# EAGLE schematic Ex Sensors (EAGLE 7.6.0)
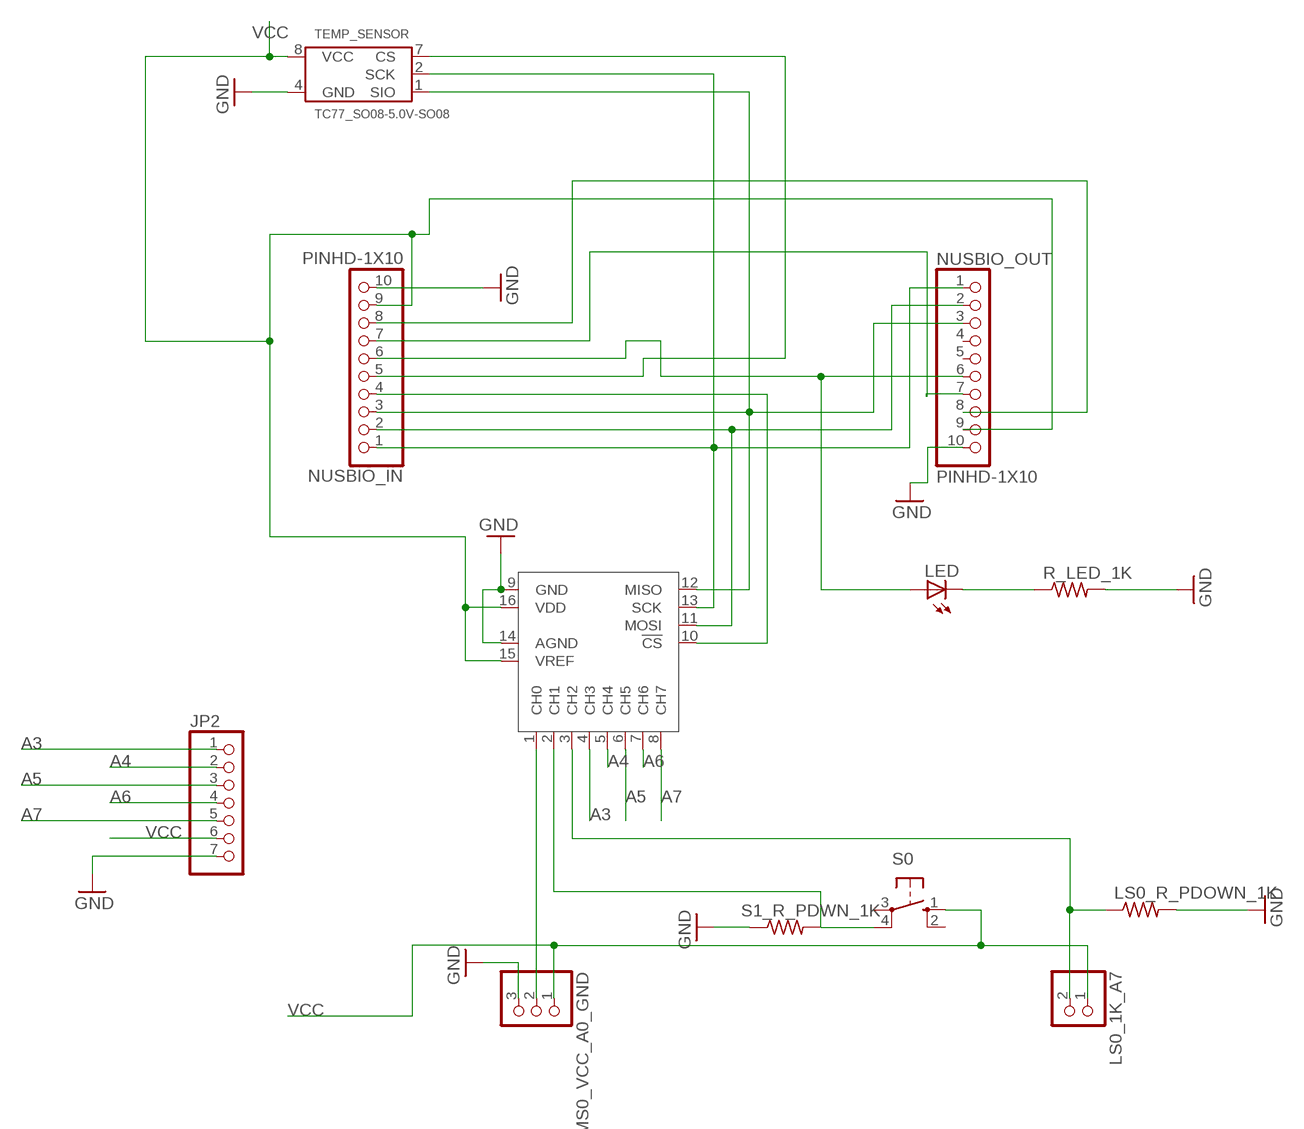
[diagram p0: schematic, sheet 1]

## Parts
JP2  PINHD-1X7  [1X07]
LED  LEDCHIPLED_0805  [CHIPLED_0805]
LS0_1K_A7  PINHD-1X2  [1X02]
LS0_R_PDOWN_1K  R-US_R0805  [R0805]
MS0_VCC_A0_GND  PINHD-1X3  [1X03]
NUSBIO_IN  PINHD-1X10  [1X10-BIG]
NUSBIO_OUT  PINHD-1X10  [1X10-BIG]
R_LED_1K  R-US_R0805  [R0805]
S0  10-XX  [B3F-10XX]
S1_R_PDWN_1K  R-US_R0805  [R0805]
TEMP_SENSOR  TC77_SO08-5.0V-SO08  [SO-08]
U$1  MCP3008SL  [SO16]

## Nets
A3: JP2.1 U$1.4(CH3)
A4: JP2.2 U$1.5(CH4)
A5: JP2.3 U$1.6(CH5)
A6: JP2.4 U$1.7(CH6)
A7: JP2.5 U$1.8(CH7)
GND: JP2.7 LS0_R_PDOWN_1K.2 MS0_VCC_A0_GND.3 NUSBIO_IN.10 NUSBIO_OUT.10 R_LED_1K.2 S1_R_PDWN_1K.1 TEMP_SENSOR.4(GND) U$1.9(GND) U$1.14(AGND)
N$1: NUSBIO_IN.1 NUSBIO_OUT.1 TEMP_SENSOR.2(SCK) U$1.13(SCK)
N$2: NUSBIO_IN.2 NUSBIO_OUT.2 U$1.11(MOSI)
N$3: NUSBIO_IN.3 NUSBIO_OUT.3 TEMP_SENSOR.1(SIO) U$1.12(MISO)
N$4: NUSBIO_IN.5 TEMP_SENSOR.7(CS)
N$5: NUSBIO_IN.4 U$1.10(!CS)
N$6: LED.C R_LED_1K.1
N$7: LED.A NUSBIO_IN.6 NUSBIO_OUT.6
N$8: NUSBIO_IN.7 NUSBIO_OUT.7
N$9: NUSBIO_IN.8 NUSBIO_OUT.8
N$10: MS0_VCC_A0_GND.2 U$1.1(CH0)
N$11: LS0_1K_A7.2 LS0_R_PDOWN_1K.1 U$1.3(CH2)
N$12: S0.4(P1) S1_R_PDWN_1K.2 U$1.2(CH1)
VCC: JP2.6 LS0_1K_A7.1 MS0_VCC_A0_GND.1 NUSBIO_IN.9 NUSBIO_OUT.9 S0.1(S) TEMP_SENSOR.8(VCC) U$1.15(VREF) U$1.16(VDD)
Unconnected: NUSBIO_OUT.4 NUSBIO_OUT.5 S0.2(S1) S0.3(P)

## Library data of the parts
JP2 = pinhead:PINHD-1X7: PIN HEADER
LED = adafruit:LED: LED OSRAM: - CHIPLED LG R971, LG N971, LY N971, LG Q971, LY Q971, LO R971, LY R971 LH N974, LH R974 LS Q976, LO Q976, LY Q976 LO Q996 - Hyper CHIPLED LW Q18S LB Q993, LB Q99A, LB R99A - SideLED LS A670, LO A670, LY A670, LG A670, LP A670 LB A673, LV A673, LT A673, LW A673 LH A674 LY A675 LS A676, LA A676, LO A676, LY A676, LW A676 LS A679, LY A679, LG A679 - Hyper Micro SIDELED® LS Y876, LA Y876, LO Y876, LY Y876 LT Y87S - SmartLED LW L88C, LW L88S LB L89C, LB L89S, LG L890 LS L89K, LO L89K, LY L89K LS L896, LA L896, LO L896, LY L896 - TOPLED LS T670, LO T670, LY T670, LG T670, LP T670 LSG T670, LSP T670, LSY T670, LOP T670, LYG T670 LG T671, LOG T671, LSG T671 LB T673, LV T673, LT T673, LW T673 LH T674 LS T676, LA T676, LO T676, LY T676, LB T676, LH T676, LSB T676, LW T676 LB T67C, LV T67C, LT T67C, LS T67K, LO T67K, LY T67K, LW E67C LS E67B, LA E67B, LO E67B, LY E67B, LB E67C, LV E67C, LT E67C LW T67C LS T679, LY T679, LG T679 LS T770, LO T770, LY T770, LG T770, LP T770 LB T773, LV T773, LT T773, LW T773 LH T774 LS E675, LA E675, LY E675, LS T675 LS T776, LA T776, LO T776, LY T776, LB T776 LHGB T686 LT T68C, LB T68C - Hyper Mini TOPLED® LB M676 - Mini TOPLED Santana® LG M470 LS M47K, LO M47K, LY M47K Source: http://www.osram.convergy.de/
LS0_1K_A7 = pinhead:PINHD-1X2: PIN HEADER
LS0_R_PDOWN_1K R_LED_1K S1_R_PDWN_1K = adafruit:R-US_: RESISTOR, American symbol
MS0_VCC_A0_GND = adafruit:PINHD-1X3: PIN HEADER
NUSBIO_IN NUSBIO_OUT = adafruit:PINHD-1X10: Pin header 1x10 0.1" spacing With round pins
S0 = switch-omron:10-XX: OMRON SWITCH; MPN: B3F-1000; OC_FARNELL: 176432; OC_NEWARK: 36M3542
TEMP_SENSOR = temperiture:TC77_SO08: Thermal Sensor with SPI™ Interface TC77 Features • Digital Temperature Sensing in 5-Pin SOT-23A and 8-Pin SOIC Packages • Outputs Temperature as a 13-Bit Digital Word • SPI and MICROWIRE™ Compatible Interface • Solid State Temperature Sensing • ±1°C (max.) accuracy from +25°C to +65°C • ±2°C (max.) accuracy from -40°C to +85°C • ±3°C (max.) accuracy from -55°C to +125°C • 2.7V to 5.5V Operating Range • Low Power - 250 μA (typ.) Continuous Conversion Mode - 0.1 μA (typ.) Shutdown Mode Typical Applications • Thermal Protection for Hard Disk Drives and Other PC Peripherals • PC Card Devices for Notebook Computers • Low Cost Thermostat Controls • Industrial Control • Office Equipment • Cellular Phones • Thermistor Replacement Description The TC77 is a serially accessible digital temperature sensor particularly suited for low cost and small formfactor applications. Temperature data is converted from the internal thermal sensing element and made available at anytime as a 13-bit two’s compliment digital word. Communication with the TC77 is accomplished via a SPI and MICROWIRE compatible interface. It has a 12-bit plus sign temperature resolution of 0.0625°C per Least Significant Bit (LSb). The TC77 offers a temperature accuracy of ±1.0°C (max.) over the temperature range of +25°C to +65°C. When operating, the TC77 consumes only 250 μA (typ.). The TC77’s Configuration register can be used to activate the low power Shutdown mode, which has a current consumption of only 0.1 μA (typ.). Small size, low cost and ease of use make the TC77 an ideal choice for implementing thermal management in a variety of systems.; MPN: TC77-5.0MOA; OC_FARNELL: 1439514; PACKAGE: SO08; SUPPLIER: MICROCHIP
U$1 = MCP3008:MCP3008